# Altium schematic sheet TX Balun.SchDoc
size A
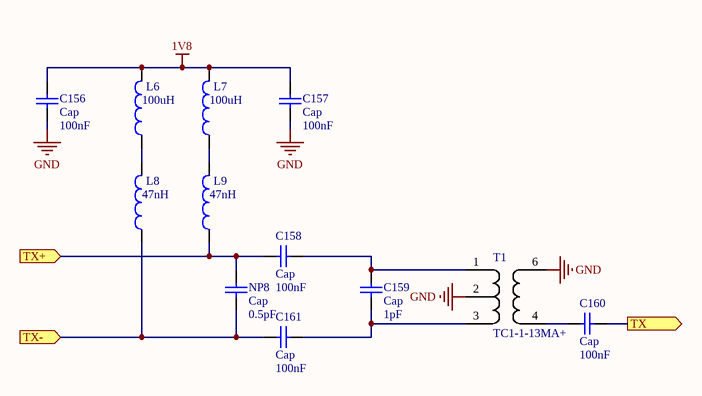
[diagram p0: TX Balun.SchDoc]

## Parts
C156  Cap  value 100nF  [0402-A]
C157  Cap  value 100nF  [0402-A]
C158  Cap  value 100nF  [0402-A]
C159  Cap  value 1pF  [0402-A]
C160  Cap  value 100nF  [0402-A]
C161  Cap  value 100nF  [0402-A]
L6  value 100uH  [6-0805_M]  (hidden comment: Inductor)
L7  value 100uH  [6-0805_M]  (hidden comment: Inductor)
L8  value 47nH  [0402-A]  (hidden comment: Inductor)
L9  value 47nH  [0402-A]  (hidden comment: Inductor)
NP8  Cap  value 0.5pF  [0402-A]
T1  TC1-1-13MA+  [TC1-1-13MA+]

## Ports
TX (out), TX+ (in), TX- (in)

## Nets
1V8: C156.2 C157.2 L6.2 L7.2
GND: C156.1 C157.1 T1.2 T1.6
TX: C160.1 ; port TX
TX+: C158.2 L9.1 NP8.2 ; port TX+
TX-: C161.2 L8.1 NP8.1 ; port TX-
NetC158_1: C158.1 C159.2 T1.1
NetC159_1: C159.1 C161.1 T1.3
NetC160_2: C160.2 T1.4
NetL6_1: L6.1 L8.2
NetL7_1: L7.1 L9.2

## Library data of the parts
C156-C161 NP8 = Cap: Capacitor; Published: 8-Jun-2000; LatestRevisionDate: 17-Jul-2002; LatestRevisionNote: Re-released for DXP Platform.; PackageReference: RAD-0.3; Publisher: Altium Limited; PackageDescription: Radial Cap, Thru-Hole; 2 Leads; 0.3 in Pin Spacing
L6-L9 = Inductor: Code_IEC: 1005; Published: 8-Jun-2000; LatestRevisionDate: 29-May-2009; LatestRevisionNote: IPC-7351 Footprint Added.; PackageReference: 0402-A; Publisher: Altium Limited; PackageDescription: Chip Inductor; Code_JEITA: 0402